# Altium schematic sheet FPGABank3X.SchDoc
size A4; SheetNumber: 7; SheetTotal: 10
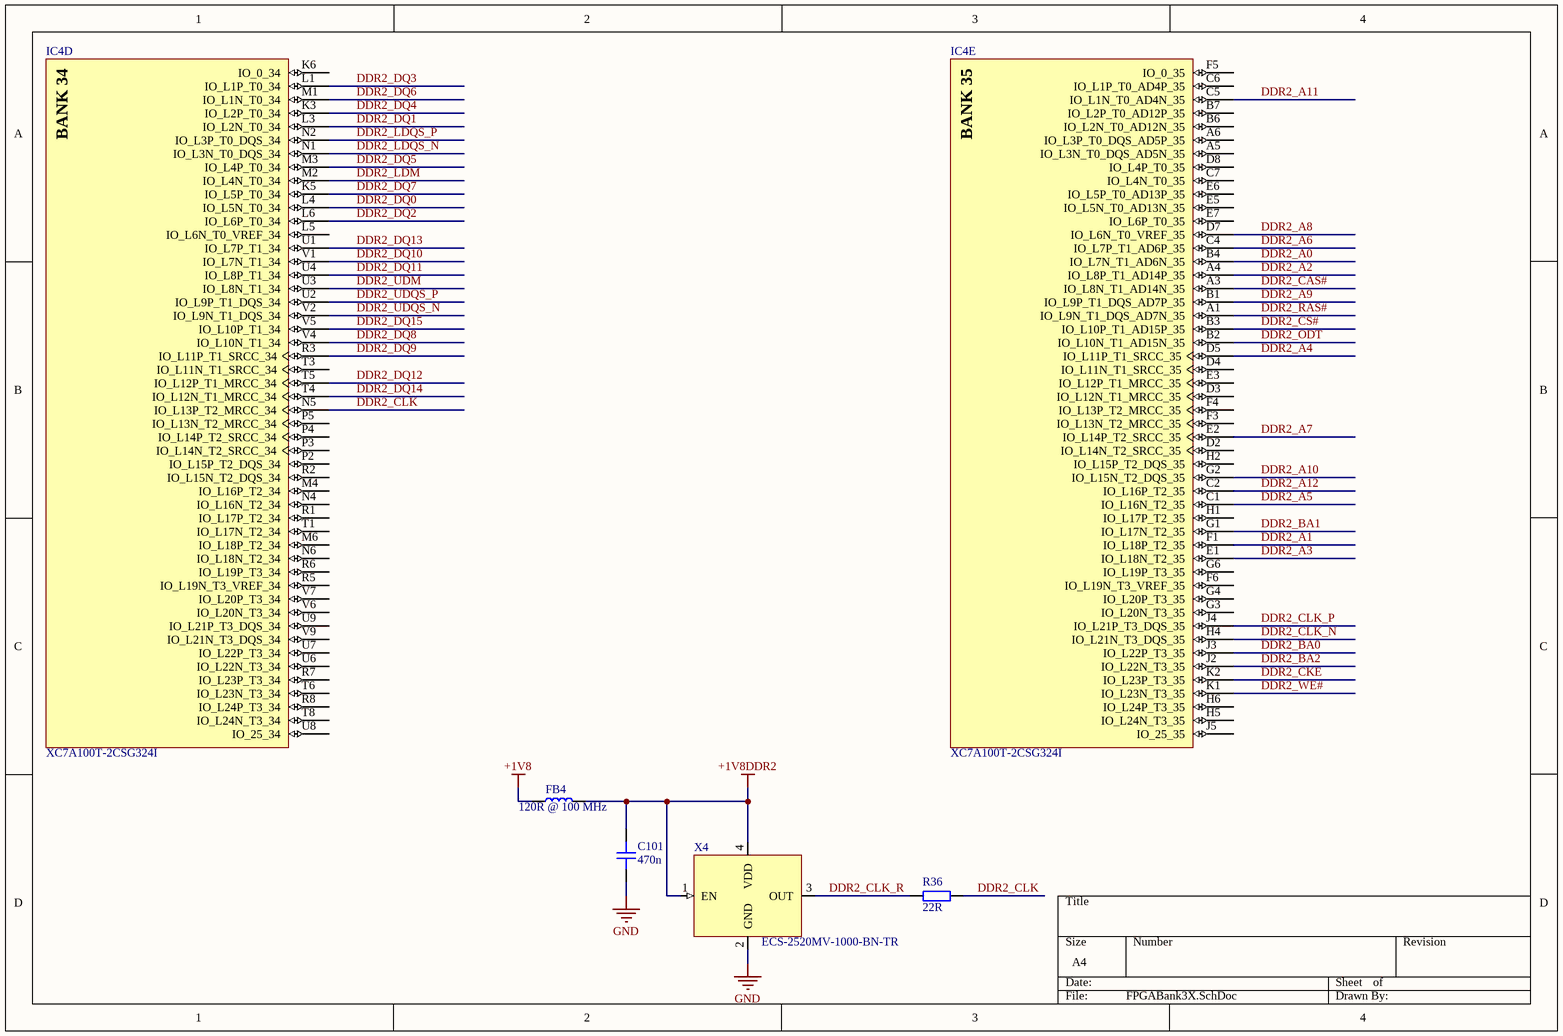
[diagram p0: FPGABank3X.SchDoc]

## Parts
C101  470n  [CAP_0201]
FB4  120R @ 100 MHz  [IND_0201]
IC4  XC7A100T-2CSG324I  [CSG324]  (parts D,E of 9)
R36  22R  [RES_0201]
X4  ECS-2520MV-1000-BN-TR  [XTAL_2520]

## Nets
+1V8: FB4.1
+1V8DDR2: C101.2 FB4.2 X4.1(EN) X4.4(VDD)
GND: C101.1 X4.2(GND)
DDR2_A0: IC4.B4(IO_L7N_T1_AD6N_35)
DDR2_A1: IC4.F1(IO_L18P_T2_35)
DDR2_A2: IC4.A4(IO_L8P_T1_AD14P_35)
DDR2_A3: IC4.E1(IO_L18N_T2_35)
DDR2_A4: IC4.D5(IO_L11P_T1_SRCC_35)
DDR2_A5: IC4.C1(IO_L16N_T2_35)
DDR2_A6: IC4.C4(IO_L7P_T1_AD6P_35)
DDR2_A7: IC4.E2(IO_L14P_T2_SRCC_35)
DDR2_A8: IC4.D7(IO_L6N_T0_VREF_35)
DDR2_A9: IC4.B1(IO_L9P_T1_DQS_AD7P_35)
DDR2_A10: IC4.G2(IO_L15N_T2_DQS_35)
DDR2_A11: IC4.C5(IO_L1N_T0_AD4N_35)
DDR2_A12: IC4.C2(IO_L16P_T2_35)
DDR2_BA0: IC4.J3(IO_L22P_T3_35)
DDR2_BA1: IC4.G1(IO_L17N_T2_35)
DDR2_BA2: IC4.J2(IO_L22N_T3_35)
DDR2_CAS#: IC4.A3(IO_L8N_T1_AD14N_35)
DDR2_CKE: IC4.K2(IO_L23P_T3_35)
DDR2_CLK: IC4.N5(IO_L13P_T2_MRCC_34) R36.2
DDR2_CLK_N: IC4.H4(IO_L21N_T3_DQS_35)
DDR2_CLK_P: IC4.J4(IO_L21P_T3_DQS_35)
DDR2_CLK_R: R36.1 X4.3(OUT)
DDR2_CS#: IC4.B3(IO_L10P_T1_AD15P_35)
DDR2_DQ0: IC4.L4(IO_L5N_T0_34)
DDR2_DQ1: IC4.L3(IO_L2N_T0_34)
DDR2_DQ2: IC4.L6(IO_L6P_T0_34)
DDR2_DQ3: IC4.L1(IO_L1P_T0_34)
DDR2_DQ4: IC4.K3(IO_L2P_T0_34)
DDR2_DQ5: IC4.M3(IO_L4P_T0_34)
DDR2_DQ6: IC4.M1(IO_L1N_T0_34)
DDR2_DQ7: IC4.K5(IO_L5P_T0_34)
DDR2_DQ8: IC4.V4(IO_L10N_T1_34)
DDR2_DQ9: IC4.R3(IO_L11P_T1_SRCC_34)
DDR2_DQ10: IC4.V1(IO_L7N_T1_34)
DDR2_DQ11: IC4.U4(IO_L8P_T1_34)
DDR2_DQ12: IC4.T5(IO_L12P_T1_MRCC_34)
DDR2_DQ13: IC4.U1(IO_L7P_T1_34)
DDR2_DQ14: IC4.T4(IO_L12N_T1_MRCC_34)
DDR2_DQ15: IC4.V5(IO_L10P_T1_34)
DDR2_LDM: IC4.M2(IO_L4N_T0_34)
DDR2_LDQS_N: IC4.N1(IO_L3N_T0_DQS_34)
DDR2_LDQS_P: IC4.N2(IO_L3P_T0_DQS_34)
DDR2_ODT: IC4.B2(IO_L10N_T1_AD15N_35)
DDR2_RAS#: IC4.A1(IO_L9N_T1_DQS_AD7N_35)
DDR2_UDM: IC4.U3(IO_L8N_T1_34)
DDR2_UDQS_N: IC4.V2(IO_L9N_T1_DQS_34)
DDR2_UDQS_P: IC4.U2(IO_L9P_T1_DQS_34)
DDR2_WE#: IC4.K1(IO_L23N_T3_35)

Not connected (* = marked no-connect by the designer): IC4 A5(IO_L3N_T0_DQS_AD5N_35) A6(IO_L3P_T0_DQS_AD5P_35) B6(IO_L2N_T0_AD12N_35) B7(IO_L2P_T0_AD12P_35) C6(IO_L1P_T0_AD4P_35) C7(IO_L4N_T0_35) D2(IO_L14N_T2_SRCC_35) D3(IO_L12N_T1_MRCC_35) D4(IO_L11N_T1_SRCC_35) D8(IO_L4P_T0_35) E3(IO_L12P_T1_MRCC_35) E5(IO_L5N_T0_AD13N_35) E6(IO_L5P_T0_AD13P_35) E7(IO_L6P_T0_35) F3(IO_L13N_T2_MRCC_35) F4(IO_L13P_T2_MRCC_35) F5(IO_0_35) F6(IO_L19N_T3_VREF_35) G3(IO_L20N_T3_35) G4(IO_L20P_T3_35) G6(IO_L19P_T3_35) H1(IO_L17P_T2_35) H2(IO_L15P_T2_DQS_35) H5(IO_L24N_T3_35) H6(IO_L24P_T3_35) J5(IO_25_35) K6(IO_0_34) L5(IO_L6N_T0_VREF_34) M4(IO_L16P_T2_34) M6(IO_L18P_T2_34) N4(IO_L16N_T2_34) N6(IO_L18N_T2_34) P2(IO_L15P_T2_DQS_34) P3(IO_L14N_T2_SRCC_34) P4(IO_L14P_T2_SRCC_34) P5(IO_L13N_T2_MRCC_34) R1(IO_L17P_T2_34) R2(IO_L15N_T2_DQS_34) R5(IO_L19N_T3_VREF_34) R6(IO_L19P_T3_34) R7(IO_L23P_T3_34) R8(IO_L24P_T3_34) T1(IO_L17N_T2_34) T3(IO_L11N_T1_SRCC_34) T6(IO_L23N_T3_34) T8(IO_L24N_T3_34) U6(IO_L22N_T3_34) U7(IO_L22P_T3_34) U8(IO_25_34) U9(IO_L21P_T3_DQS_34) V6(IO_L20N_T3_34) V7(IO_L20P_T3_34) V9(IO_L21N_T3_DQS_34)

## Notes on the sheet
- (in symbol XC7A100T-2CSG324I, part D) BANK 34
- (in symbol XC7A100T-2CSG324I, part E) BANK 35

## Library data of the parts
C101 = CAP_0201: Capacitor SMD 0201; Manufacturer: *; Manufacturer Part Number: *; Distributor Link: *; LCSC: *; Rating: *; Dielectric: *
FB4 = IND_0201: Inductor SMD 0201; Manufacturer_Name: Murata Electronics; Manufacturer_Part_Number: LQP03HQ56NH02D; Datasheet Link: https://psearch.en.murata.com/inductor/product/LQP03HQ56NH02%23.html; Height: 0.42mm; Mouser Part Number: 81-LQP03HQ56NH02D; Mouser Price/Stock: https://www.mouser.co.uk/ProductDetail/Murata-Electronics/LQP03HQ56NH02D?qs=B6kkDfuK7%2FBQu1Ob9%2FT2Bg%3D%3D
IC4 = XC7A100T-2CSG324I: Artix-7 FPGA, 210 User I/Os, 0 GTP, 324-Ball BGA, Speed Grade 2, Industrial Grade, Pb-Free; Manufacturer: Xilinx; Logic Cells: 101440; DSP48E1 Slices: 240; Block RAM Blocks (Max Kb): 4860; Clock Mgmt Tiles (CMTs): 6; Max User I/O: 300; CLBs (Slices): 15850; Block RAM Blocks (18Kb): 270; Speed Grade: -2; Block RAM Blocks (36Kb): 135; ComponentLink1Description: Datasheet; ComponentLink3Description: DC and Switching Characteristics; Generic Part Number: XC7A100T; RoHS: Pb-Free; Mounting Technology: Surface Mount; PackageReference: CSG324; ComponentLink4URL: http://www.xilinx.com/support/packagefiles/a7packages/xc7a100tcsg324pkg.txt; NexusDeviceID: XC7A100T-2CSG324I; PackageVersion: Rev 1.8; PartNumber: XC7A100T-2CSG324I; CLBs (Max Distributed RAM Kb): 1188; Code_JEDEC: MO-275-KKAC-1; ComponentLink2Description: Package Specification; ComponentLink1URL: http://www.xilinx.com/support/documentation/data_sheets/ds180_7Series_Overview.pdf; ComponentLink3URL: http://www.xilinx.com/support/documentation/data_sheets/ds181_Artix_7_Data_Sheet.pdf; ComponentLink5URL: http://www.xilinx.com/support/documentation/user_guides/ug475_7Series_Pkg_Pinout.pdf; PackageDescription: Wire-Bond Chip-Scale BGA, Body 15 x 15 mm, 0.8 mm Pitch; ComponentLink4Description: Package File; DatasheetVersion: v1.12; ComponentLink2URL: http://www.xilinx.com/support/documentation/user_guides/ug475_7Series_Pkg_Pinout.pdf; ComponentLink5Description: Packaging and Pinout
R36 = RES_0201: Resistor SMD 0201; Manufacturer: *; Manufacturer Part Number: *; Distributor Link: *; LCSC: *
X4 = ECS-2520MV-130-BN-TR: Standard Clock Oscillators XO (Standard),13MHz,Standby (Power Down),CMOS, Multi-Volt,1.6 V 3.6 V,+/-50ppm,-40 C 85 C,6mA,Surface Mount,4-SMD, No Lead,(2.50mm x 2.00mm),(0.80mm); Manufacturer: ECS; Manufacturer Part Number: ECS-2520MV-130-BN-TR